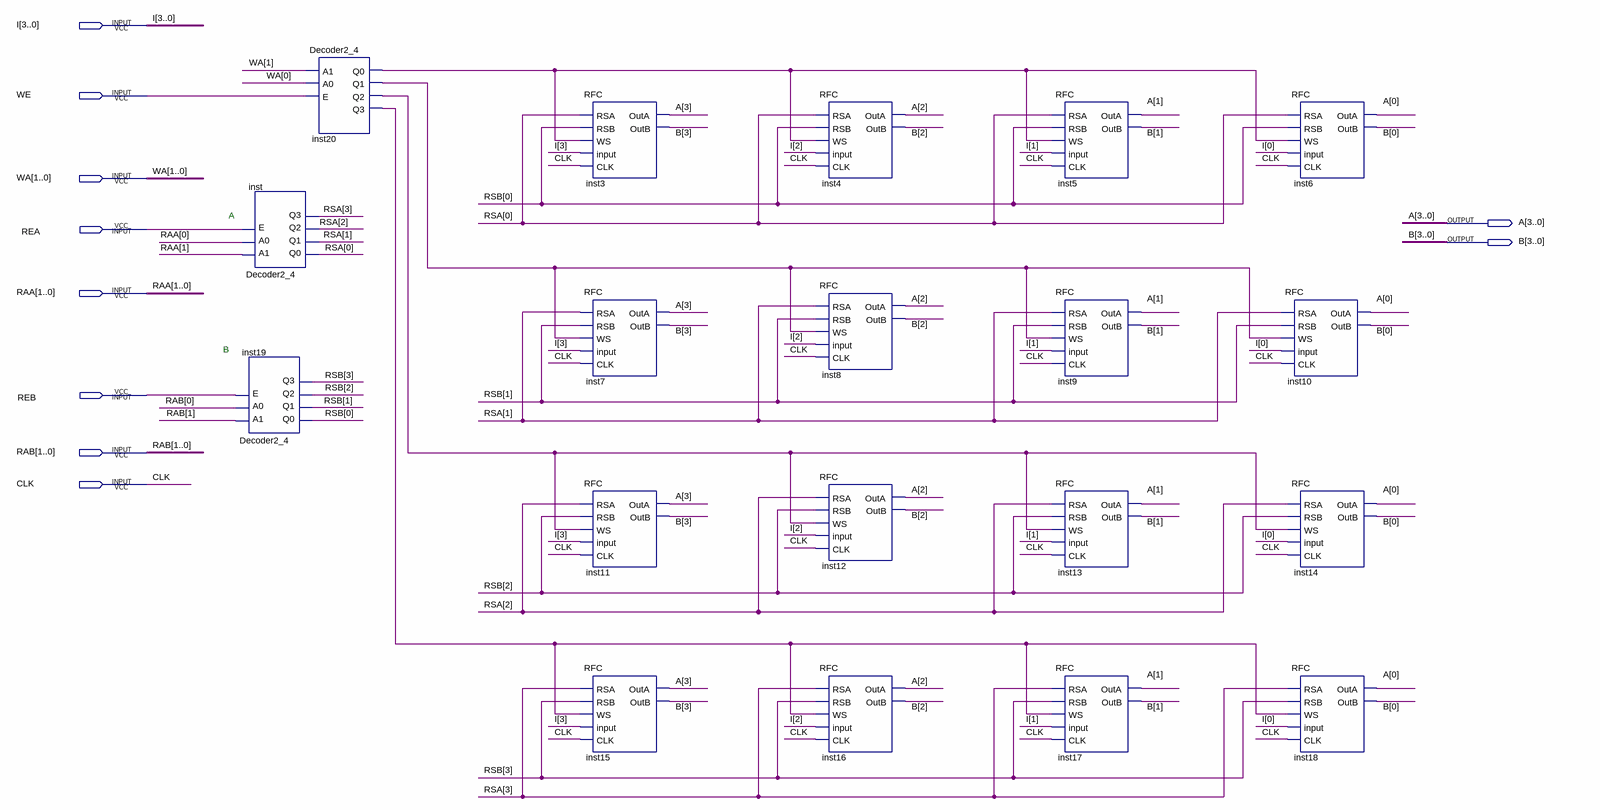
[diagram p0: schematic sheet]
// Quartus schematic register.bdf as structural Verilog: 19 symbols, 10 pins
module register (
  input  [3:0] I,
  input  WE,
  input  [1:0] WA,
  input  REA,
  input  [1:0] RAA,
  input  REB,
  input  [1:0] RAB,
  input  CLK,
  output [3:0] A,
  output [3:0] B
);

  wire inst20_q0, inst20_q1, inst20_q2, inst20_q3;
  wire [3:0] RSA, RSB;

  Decoder2_4 inst (.A1(RAA[1]), .A0(RAA[0]), .E(REA), .Q0(RSA[0]), .Q1(RSA[1]), .Q2(RSA[2]), .Q3(RSA[3]));
  Decoder2_4 inst19 (.A1(RAB[1]), .A0(RAB[0]), .E(REB), .Q0(RSB[0]), .Q1(RSB[1]), .Q2(RSB[2]), .Q3(RSB[3]));
  Decoder2_4 inst20 (.A1(WA[1]), .A0(WA[0]), .E(WE), .Q0(inst20_q0), .Q1(inst20_q1), .Q2(inst20_q2), .Q3(inst20_q3));
  RFC inst3 (.RSA(RSA[0]), .RSB(RSB[0]), .WS(inst20_q0), .\input (I[3]), .CLK(CLK), .OutA(A[3]), .OutB(B[3]));
  RFC inst7 (.RSA(RSA[1]), .RSB(RSB[1]), .WS(inst20_q1), .\input (I[3]), .CLK(CLK), .OutA(A[3]), .OutB(B[3]));
  RFC inst11 (.RSA(RSA[2]), .RSB(RSB[2]), .WS(inst20_q2), .\input (I[3]), .CLK(CLK), .OutA(A[3]), .OutB(B[3]));
  RFC inst15 (.RSA(RSA[3]), .RSB(RSB[3]), .WS(inst20_q3), .\input (I[3]), .CLK(CLK), .OutA(A[3]), .OutB(B[3]));
  RFC inst4 (.RSA(RSA[0]), .RSB(RSB[0]), .WS(inst20_q0), .\input (I[2]), .CLK(CLK), .OutA(A[2]), .OutB(B[2]));
  RFC inst8 (.RSA(RSA[1]), .RSB(RSB[1]), .WS(inst20_q1), .\input (I[2]), .CLK(CLK), .OutA(A[2]), .OutB(B[2]));
  RFC inst12 (.RSA(RSA[2]), .RSB(RSB[2]), .WS(inst20_q2), .\input (I[2]), .CLK(CLK), .OutA(A[2]), .OutB(B[2]));
  RFC inst16 (.RSA(RSA[3]), .RSB(RSB[3]), .WS(inst20_q3), .\input (I[2]), .CLK(CLK), .OutA(A[2]), .OutB(B[2]));
  RFC inst5 (.RSA(RSA[0]), .RSB(RSB[0]), .WS(inst20_q0), .\input (I[1]), .CLK(CLK), .OutA(A[1]), .OutB(B[1]));
  RFC inst9 (.RSA(RSA[1]), .RSB(RSB[1]), .WS(inst20_q1), .\input (I[1]), .CLK(CLK), .OutA(A[1]), .OutB(B[1]));
  RFC inst13 (.RSA(RSA[2]), .RSB(RSB[2]), .WS(inst20_q2), .\input (I[1]), .CLK(CLK), .OutA(A[1]), .OutB(B[1]));
  RFC inst17 (.RSA(RSA[3]), .RSB(RSB[3]), .WS(inst20_q3), .\input (I[1]), .CLK(CLK), .OutA(A[1]), .OutB(B[1]));
  RFC inst6 (.RSA(RSA[0]), .RSB(RSB[0]), .WS(inst20_q0), .\input (I[0]), .CLK(CLK), .OutA(A[0]), .OutB(B[0]));
  RFC inst10 (.RSA(RSA[1]), .RSB(RSB[1]), .WS(inst20_q1), .\input (I[0]), .CLK(CLK), .OutA(A[0]), .OutB(B[0]));
  RFC inst14 (.RSA(RSA[2]), .RSB(RSB[2]), .WS(inst20_q2), .\input (I[0]), .CLK(CLK), .OutA(A[0]), .OutB(B[0]));
  RFC inst18 (.RSA(RSA[3]), .RSB(RSB[3]), .WS(inst20_q3), .\input (I[0]), .CLK(CLK), .OutA(A[0]), .OutB(B[0]));

  // Notes on the sheet:
  //   A
  //   B
endmodule
